# Altium schematic sheet Main_Sheet.SchDoc
size A; SheetNumber: 1; SheetTotal: 1
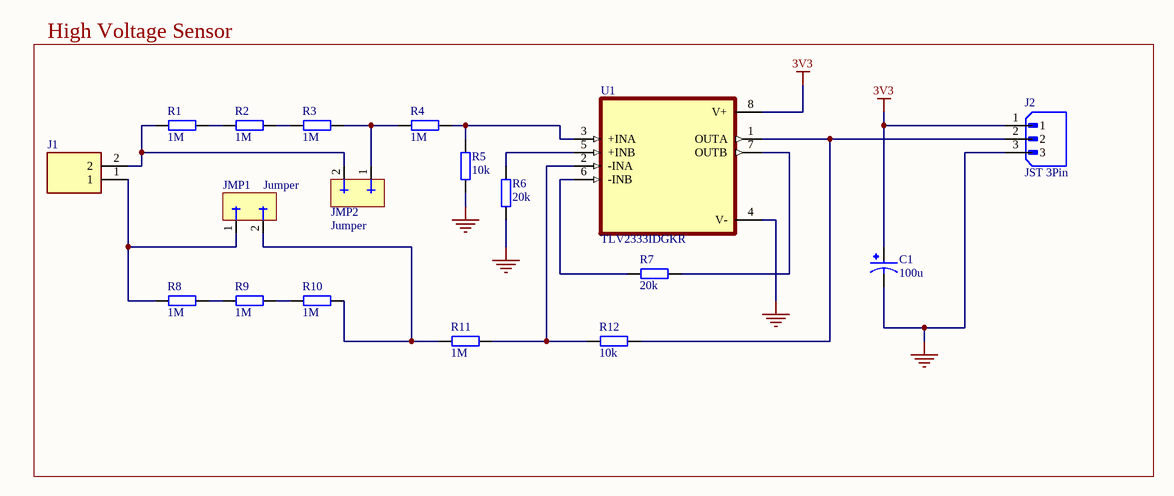
[diagram p0: Main_Sheet.SchDoc]

## Parts
C1  100u  [CAP_EEEHA0J101WR]
J1  (no value)  [TE_282845-2]
J2  JST 3Pin  [JST_B3B-XH-A(LF)(SN)]
JMP1  Jumper  [JMP2_TH]
JMP2  Jumper  [JMP2_TH]
R1  1M  [RES_0805]
R2  1M  [RES_0805]
R3  1M  [RES_0805]
R4  1M  [RES_0805]
R5  10k  [RES_0805]
R6  20k  [RES_0805]
R7  20k  [RES_0805]
R8  1M  [RES_0805]
R9  1M  [RES_0805]
R10  1M  [RES_0805]
R11  1M  [RES_0805]
R12  10k  [RES_0805]
U1  TLV2333IDGKR  [SOP65P490X110-8N]

## Blocks framed on the sheet
High Voltage Sensor: C1 J1 J2 JMP1 JMP2 R1-R12 U1

## Nets
3V3: C1.1 J2.1 U1.8(V+)
GND: C1.2 J2.3 R5.1 R6.1 U1.4(V-)
NetJ1_1: J1.1 JMP1.1 R8.1
NetJ1_2: J1.2 JMP2.2 R1.1
NetJ2_2: J2.2 R12.1 U1.1(OUTA)
NetJMP1_2: JMP1.2 R10.2 R11.1
NetJMP2_1: JMP2.1 R3.2 R4.1
NetR1_2: R1.2 R2.1
NetR2_2: R2.2 R3.1
NetR4_2: R4.2 R5.2 U1.3(+INA)
NetR6_2: R6.2 U1.5(+INB)
NetR7_1: R7.1 U1.7(OUTB)
NetR7_2: R7.2 U1.6(-INB)
NetR8_2: R8.2 R9.1
NetR9_2: R9.2 R10.1
NetR11_2: R11.2 R12.2 U1.2(-INA)

## Library data of the parts
C1 = EEEHA0J101WR: CAPACITOR ALUM ELEC, 100UF, 20%, 6.3V, S; CAPACITOR ALUM ELEC, 100UF, 20%, 6.3V, SMD; Product Range:PANASONIC - HA Series; Capacitance:100ÂµF; Capacitance Tolerance:Â± 20%; Voltage Rating:6.3V; Capacitor Case Style:Radial Can - SMD; Diameter:5mm; Height:5.4mm; Series:HA; MF: Panasonic Electronic; MP: EEE-HA0J101WR; Availability: In Stock; Check_prices: https://www.snapeda.com/parts/EEE-HA0J101WR/Panasonic%20Electronic%20Components/view-part/2733110/?ref=eda; SnapEDA_Link: https://www.snapeda.com/parts/EEE-HA0J101WR/Panasonic%20Electronic%20Components/view-part/2733110/?ref=snap; Purchase-URL: https://pricing.snapeda.com/search/part/EEE-HA0J101WR/?ref=eda; Package: RADIAL-2 Panasonic; Value: *; Price: None
J1 = 282845-2: Connector Terminal Blocks 2 POS 7.62mm Solder ST Thru-Hole; Centerline_Pitch: 7.62 mm[.3 in]; Number_of_Positions: 2; MF: TE Connectivity; EU_RoHS_Compliance: Compliant with Exemptions; Price: None; Package: None; TE_purchase_URL: https://www.te.com/usa-en/product-282845-2.html?te_bu=Cor&te_type=disp&te_campaign=seda_glo_cor-seda-global-disp-prtnr-fy19-seda-model-bom-cta_sma-317_1&elqCampaignId=32493; Value: *; MP: 282845-2; Availability: Unavailable; SnapEDA_Link: https://www.snapeda.com/parts/282845-2/TE%20Connectivity%20AMP%20Connectors/view-part/533912/?ref=snap
J2 = JST 3Pin: Connector Header Through Hole 3 position 0.098 (2.50mm); MF: JST Sales; MP: B3B-XH-A(LF)(SN); SnapEDA_Link: https://www.snapeda.com/parts/B3B-XH-A(LF)(SN)/JST+Sales+America+Inc./view-part/?ref=snap; Package: None; Value: *; Check_prices: https://www.snapeda.com/parts/B3B-XH-A(LF)(SN)/JST+Sales+America+Inc./view-part/?ref=eda
JMP1 JMP2 = JMP2_TH: Jumper 2 Pins Through-Hole DO NOT PLACE
R1-R12 = RES_0805: Resistor SMD 0805; Manufacturer: *; Manufacturer Part Number: *; Distributor Link: *; LCSC: *
U1 = TLV2333IDGKR: Dual, 350 kHz, Low-Noise, RRIO, CMOS Operational Amplifier for Cost-Sensitive Systems 8-VSSOP -40 to 125; MF: Texas Instruments; Value: *; Availability: Good; SnapEDA_Link: https://www.snapeda.com/parts/TLV2333IDGKR/Texas%20Instruments/view-part/1239792/?ref=snap; Package: VSSOP-8 Texas Instruments; Purchase-URL: https://pricing.snapeda.com/search/part/TLV2333IDGKR/?ref=eda; MP: TLV2333IDGKR; Price: None